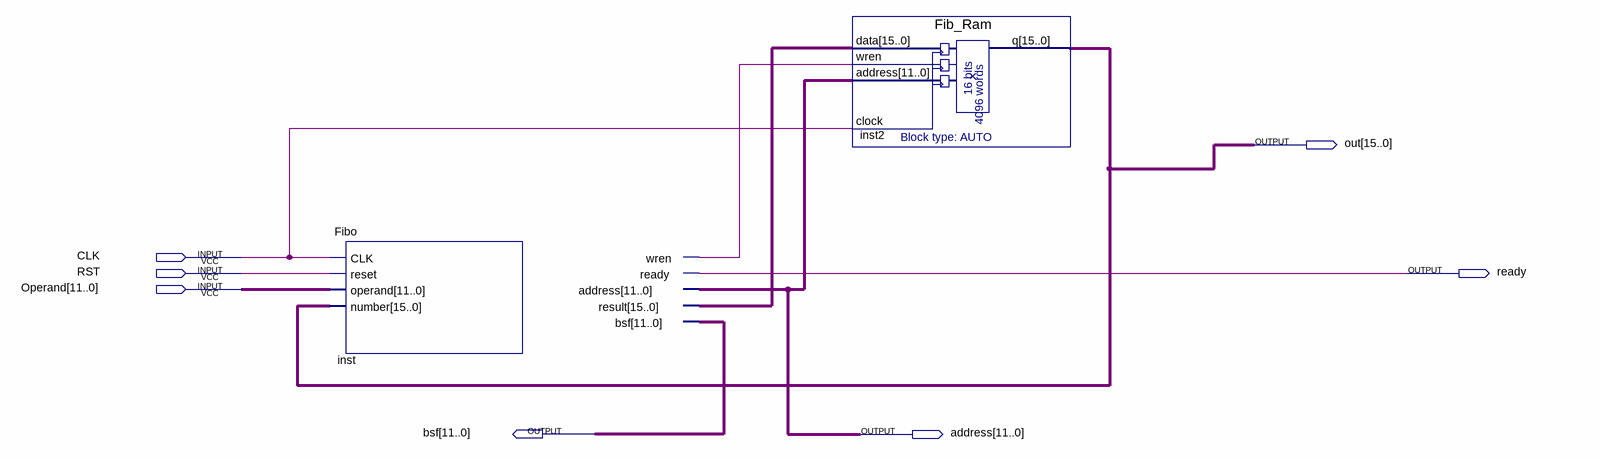
[diagram p0: schematic sheet]
// Quartus schematic trial.bdf as structural Verilog: 2 symbols, 7 pins
module trial (
  input  CLK,
  input  RST,
  input  [11:0] Operand,
  output [15:0] out,
  output ready,
  output [11:0] bsf,
  output [11:0] address
);

  wire inst_wren;
  wire [15:0] inst_result;

  Fibo inst (
    .CLK(CLK), .reset(RST), .operand(Operand), .number(out), .wren(inst_wren), .ready(ready),
    .address(address), .result(inst_result), .bsf(bsf));
  Fib_Ram inst2 (.data(inst_result), .wren(inst_wren), .address(address), .clock(CLK), .q(out));
endmodule
